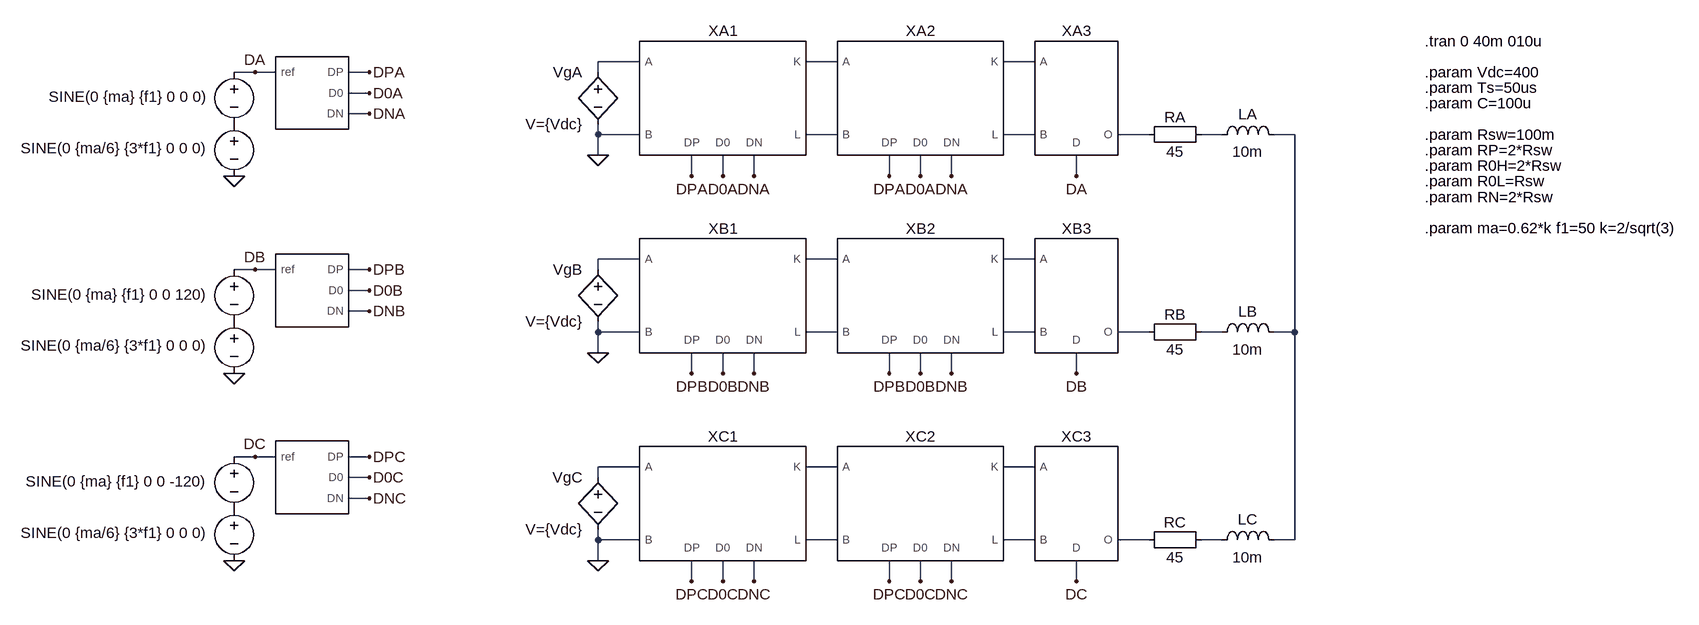
[diagram p0: schematic PN_3ph_6L_inverter.asc]
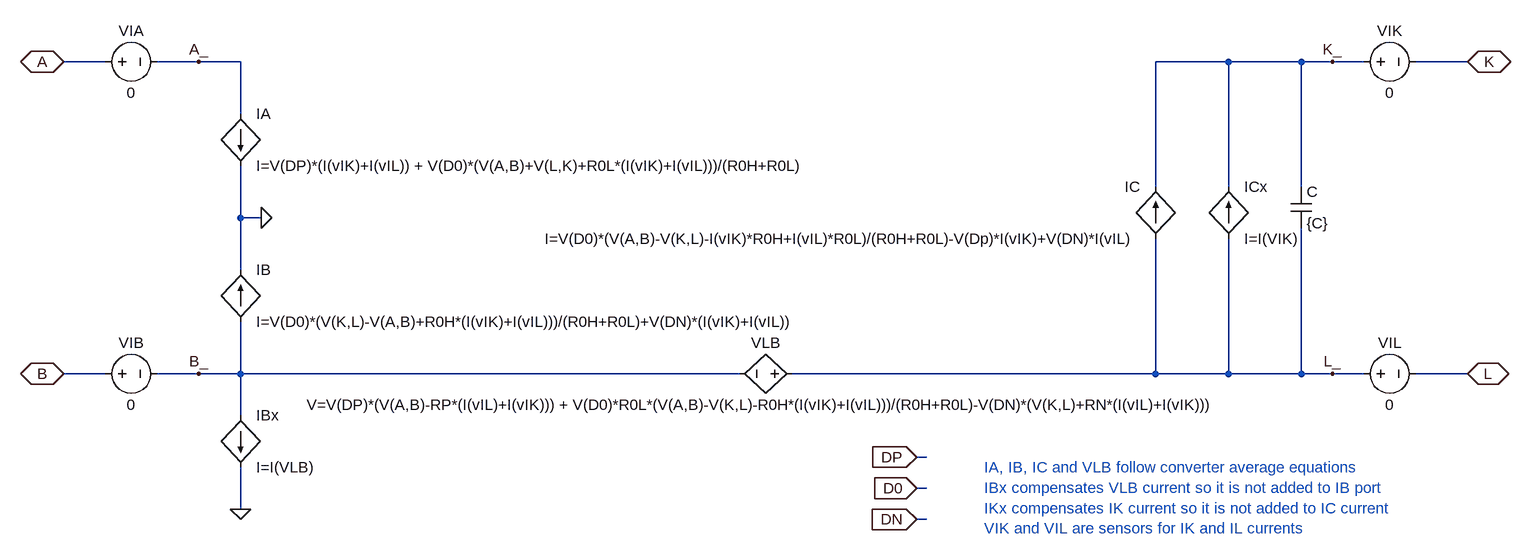
[diagram p1: sub-circuit pn_average_model.asc]
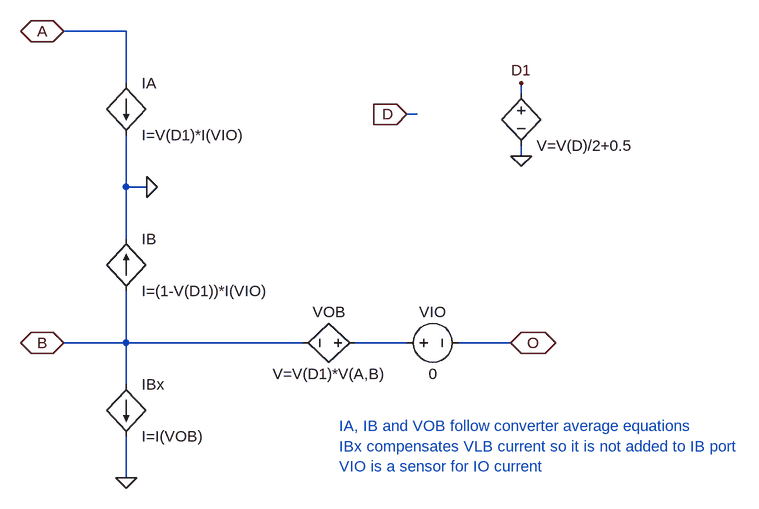
[diagram p2: sub-circuit 2l_average_model.asc]
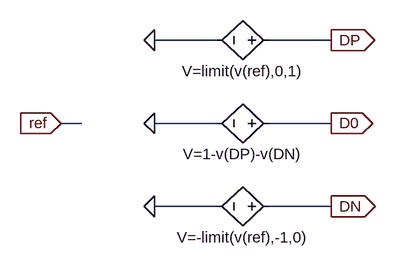
[diagram p3: sub-circuit pn_average_modulator.asc]
PN_3ph_6L_inverter.asc, the LTspice schematic file:
Version 4
SHEET 1 4356 1844
WIRE 1872 -1504 1808 -1504
WIRE 2176 -1504 2128 -1504
WIRE 2480 -1504 2432 -1504
WIRE 1280 -1488 1248 -1488
WIRE 1312 -1488 1280 -1488
WIRE 1456 -1488 1424 -1488
WIRE 1808 -1488 1808 -1504
WIRE 1456 -1456 1424 -1456
WIRE 1456 -1424 1424 -1424
WIRE 1808 -1392 1808 -1408
WIRE 1872 -1392 1808 -1392
WIRE 2176 -1392 2128 -1392
WIRE 2480 -1392 2432 -1392
WIRE 2656 -1392 2608 -1392
WIRE 2768 -1392 2736 -1392
WIRE 2880 -1392 2848 -1392
WIRE 1808 -1360 1808 -1392
WIRE 1952 -1328 1952 -1360
WIRE 2000 -1328 2000 -1360
WIRE 2048 -1328 2048 -1360
WIRE 2256 -1328 2256 -1360
WIRE 2304 -1328 2304 -1360
WIRE 2352 -1328 2352 -1360
WIRE 2544 -1328 2544 -1360
WIRE 1872 -1200 1808 -1200
WIRE 2176 -1200 2128 -1200
WIRE 2480 -1200 2432 -1200
WIRE 1280 -1184 1248 -1184
WIRE 1312 -1184 1280 -1184
WIRE 1456 -1184 1424 -1184
WIRE 1808 -1184 1808 -1200
WIRE 1456 -1152 1424 -1152
WIRE 1456 -1120 1424 -1120
WIRE 1808 -1088 1808 -1104
WIRE 1872 -1088 1808 -1088
WIRE 2176 -1088 2128 -1088
WIRE 2480 -1088 2432 -1088
WIRE 2656 -1088 2608 -1088
WIRE 2768 -1088 2736 -1088
WIRE 2880 -1088 2880 -1392
WIRE 2880 -1088 2848 -1088
WIRE 1808 -1056 1808 -1088
WIRE 1952 -1024 1952 -1056
WIRE 2000 -1024 2000 -1056
WIRE 2048 -1024 2048 -1056
WIRE 2256 -1024 2256 -1056
WIRE 2304 -1024 2304 -1056
WIRE 2352 -1024 2352 -1056
WIRE 2544 -1024 2544 -1056
WIRE 1280 -896 1248 -896
WIRE 1312 -896 1280 -896
WIRE 1456 -896 1424 -896
WIRE 1872 -880 1808 -880
WIRE 2176 -880 2128 -880
WIRE 2480 -880 2432 -880
WIRE 1456 -864 1424 -864
WIRE 1808 -864 1808 -880
WIRE 1456 -832 1424 -832
WIRE 1808 -768 1808 -784
WIRE 1872 -768 1808 -768
WIRE 2176 -768 2128 -768
WIRE 2480 -768 2432 -768
WIRE 2656 -768 2608 -768
WIRE 2768 -768 2736 -768
WIRE 2880 -768 2880 -1088
WIRE 2880 -768 2848 -768
WIRE 1808 -736 1808 -768
WIRE 1952 -704 1952 -736
WIRE 2000 -704 2000 -736
WIRE 2048 -704 2048 -736
WIRE 2256 -704 2256 -736
WIRE 2304 -704 2304 -736
WIRE 2352 -704 2352 -736
WIRE 2544 -704 2544 -736
FLAG 1456 -1488 DPA
FLAG 1456 -1456 D0A
FLAG 1456 -1424 DNA
FLAG 1952 -1328 DPA
FLAG 2000 -1328 D0A
FLAG 2048 -1328 DNA
FLAG 1808 -1360 0
FLAG 1952 -1024 DPB
FLAG 2000 -1024 D0B
FLAG 2048 -1024 DNB
FLAG 1808 -1056 0
FLAG 1952 -704 DPC
FLAG 2000 -704 D0C
FLAG 2048 -704 DNC
FLAG 1808 -736 0
FLAG 1248 -1328 0
FLAG 2256 -1328 DPA
FLAG 2304 -1328 D0A
FLAG 2352 -1328 DNA
FLAG 1456 -1184 DPB
FLAG 1456 -1152 D0B
FLAG 1456 -1120 DNB
FLAG 1248 -1024 0
FLAG 1456 -896 DPC
FLAG 1456 -864 D0C
FLAG 1456 -832 DNC
FLAG 1248 -736 0
FLAG 2256 -1024 DPB
FLAG 2304 -1024 D0B
FLAG 2352 -1024 DNB
FLAG 2256 -704 DPC
FLAG 2304 -704 D0C
FLAG 2352 -704 DNC
FLAG 1280 -896 DC
FLAG 1280 -1184 DB
FLAG 1280 -1488 DA
FLAG 2544 -1328 DA
FLAG 2544 -1024 DB
FLAG 2544 -704 DC
SYMBOL bv 1808 -1504 M0
SYMATTR InstName VgA
SYMATTR Value V={Vdc}
SYMBOL Misc/EuropeanResistor 2640 -1376 R270
WINDOW 0 27 56 VTop 2
WINDOW 3 5 56 VBottom 2
SYMATTR InstName RA
SYMATTR Value 45
SYMBOL ind 2752 -1376 R270
WINDOW 0 32 56 VTop 2
WINDOW 3 5 56 VBottom 2
SYMATTR InstName LA
SYMATTR Value 10m
SYMBOL PN_average_model 2000 -1456 R0
SYMATTR InstName XA1
SYMATTR SpiceLine C={C} RP={RP} R0H={R0H} R0L={R0L} RN={RN}
SYMBOL PN_average_model 2304 -1456 R0
SYMATTR InstName XA2
SYMATTR SpiceLine C={C} RP={RP} R0H={R0H} R0L={R0L} RN={RN}
SYMBOL bv 1808 -1200 M0
SYMATTR InstName VgB
SYMATTR Value V={Vdc}
SYMBOL Misc/EuropeanResistor 2640 -1072 R270
WINDOW 0 27 56 VTop 2
WINDOW 3 5 56 VBottom 2
SYMATTR InstName RB
SYMATTR Value 45
SYMBOL ind 2752 -1072 R270
WINDOW 0 32 56 VTop 2
WINDOW 3 5 56 VBottom 2
SYMATTR InstName LB
SYMATTR Value 10m
SYMBOL PN_average_model 2000 -1152 R0
SYMATTR InstName XB1
SYMATTR SpiceLine C={C} RP={RP} R0H={R0H} R0L={R0L} RN={RN}
SYMBOL PN_average_model 2304 -1152 R0
SYMATTR InstName XB2
SYMATTR SpiceLine C={C} RP={RP} R0H={R0H} R0L={R0L} RN={RN}
SYMBOL bv 1808 -880 M0
SYMATTR InstName VgC
SYMATTR Value V={Vdc}
SYMBOL Misc/EuropeanResistor 2640 -752 R270
WINDOW 0 27 56 VTop 2
WINDOW 3 5 56 VBottom 2
SYMATTR InstName RC
SYMATTR Value 45
SYMBOL ind 2752 -752 R270
WINDOW 0 32 56 VTop 2
WINDOW 3 5 56 VBottom 2
SYMATTR InstName LC
SYMATTR Value 10m
SYMBOL PN_average_model 2000 -832 R0
SYMATTR InstName XC1
SYMATTR SpiceLine C={C} RP={RP} R0H={R0H} R0L={R0L} RN={RN}
SYMBOL PN_average_model 2304 -832 R0
SYMATTR InstName XC2
SYMATTR SpiceLine C={C} RP={RP} R0H={R0H} R0L={R0L} RN={RN}
SYMBOL voltage 1248 -1504 M0
WINDOW 0 24 16 Invisible 2
WINDOW 3 39 54 Left 2
SYMATTR InstName V1
SYMATTR Value SINE(0 {ma} {f1} 0 0 0)
SYMBOL voltage 1248 -1424 M0
WINDOW 0 24 16 Invisible 2
WINDOW 3 39 53 Left 2
SYMATTR InstName V2
SYMATTR Value SINE(0 {ma/6} {3*f1} 0 0 0)
SYMBOL voltage 1248 -1200 M0
WINDOW 0 24 16 Invisible 2
WINDOW 3 39 54 Left 2
SYMATTR InstName V3
SYMATTR Value SINE(0 {ma} {f1} 0 0 120)
SYMBOL voltage 1248 -1120 M0
WINDOW 0 24 16 Invisible 2
WINDOW 3 39 53 Left 2
SYMATTR InstName V4
SYMATTR Value SINE(0 {ma/6} {3*f1} 0 0 0)
SYMBOL voltage 1248 -912 M0
WINDOW 0 24 16 Invisible 2
WINDOW 3 39 54 Left 2
SYMATTR InstName V5
SYMATTR Value SINE(0 {ma} {f1} 0 0 -120)
SYMBOL voltage 1248 -832 M0
WINDOW 0 24 16 Invisible 2
WINDOW 3 39 53 Left 2
SYMATTR InstName V6
SYMATTR Value SINE(0 {ma/6} {3*f1} 0 0 0)
SYMBOL 2L_average_model 2544 -1472 R0
SYMATTR InstName XA3
SYMBOL 2L_average_model 2544 -1168 R0
SYMATTR InstName XB3
SYMBOL 2L_average_model 2544 -848 R0
SYMATTR InstName XC3
SYMBOL PN_average_modulator 1360 -1456 R0
WINDOW 0 8 -56 Invisible 2
SYMATTR InstName X1
SYMBOL PN_average_modulator 1360 -1152 R0
WINDOW 0 8 -56 Invisible 2
SYMATTR InstName X2
SYMBOL PN_average_modulator 1360 -864 R0
WINDOW 0 8 -56 Invisible 2
SYMATTR InstName X3
TEXT 3080 -1464 Left 2 !.param Ts=50us
TEXT 3080 -1536 Left 2 !.tran 0 40m 010u
TEXT 3080 -1488 Left 2 !.param Vdc=400
TEXT 3080 -1248 Left 2 !.param ma=0.62*k f1=50 k=2/sqrt(3)
TEXT 3080 -1392 Left 2 !.param Rsw=100m
TEXT 3080 -1368 Left 2 !.param RP=2*Rsw
TEXT 3080 -1296 Left 2 !.param RN=2*Rsw
TEXT 3080 -1344 Left 2 !.param R0H=2*Rsw
TEXT 3080 -1320 Left 2 !.param R0L=Rsw
TEXT 3080 -1440 Left 2 !.param C=100u

pn_average_model.asc, the sub-circuit schematic file:
Version 4
SHEET 1 2060 780
WIRE -720 16 -784 16
WIRE -576 16 -640 16
WIRE -512 16 -576 16
WIRE 1008 16 896 16
WIRE 1120 16 1008 16
WIRE 1168 16 1120 16
WIRE 1216 16 1168 16
WIRE 1376 16 1296 16
WIRE -512 96 -512 16
WIRE 896 208 896 16
WIRE 1008 208 1008 16
WIRE 1120 208 1120 16
WIRE -512 256 -512 176
WIRE -480 256 -512 256
WIRE -512 336 -512 256
WIRE -720 496 -784 496
WIRE -576 496 -640 496
WIRE -512 496 -512 416
WIRE -512 496 -576 496
WIRE 256 496 -512 496
WIRE 896 496 896 288
WIRE 896 496 336 496
WIRE 1008 496 1008 288
WIRE 1008 496 896 496
WIRE 1120 496 1120 272
WIRE 1120 496 1008 496
WIRE 1168 496 1120 496
WIRE 1216 496 1168 496
WIRE 1376 496 1296 496
WIRE -512 560 -512 496
WIRE 544 624 528 624
WIRE 544 672 528 672
WIRE -512 704 -512 640
WIRE 544 720 528 720
FLAG 1376 16 K
IOPIN 1376 16 BiDir
FLAG 1376 496 L
IOPIN 1376 496 BiDir
FLAG -784 16 A
IOPIN -784 16 BiDir
FLAG -784 496 B
IOPIN -784 496 BiDir
FLAG 528 624 DP
IOPIN 528 624 In
FLAG 528 672 D0
IOPIN 528 672 In
FLAG 528 720 DN
IOPIN 528 720 In
FLAG -480 256 0
FLAG -512 704 0
FLAG -576 16 A_
FLAG -576 496 B_
FLAG 1168 16 K_
FLAG 1168 496 L_
SYMBOL bv 352 496 R90
WINDOW 0 -32 56 VBottom 2
WINDOW 3 32 56 VTop 2
SYMATTR InstName VLB
SYMATTR Value V=V(DP)*(V(A,B)-RP*(I(vIL)+I(vIK))) + V(D0)*R0L*(V(A,B)-V(K,L)-R0H*(I(vIK)+I(vIL)))/(R0H+R0L)-V(DN)*(V(K,L)+RN*(I(vIL)+I(vIK)))
SYMBOL bi -512 96 R0
SYMATTR InstName IA
SYMATTR Value I=V(DP)*(I(vIK)+I(vIL)) + V(D0)*(V(A,B)+V(L,K)+R0L*(I(vIK)+I(vIL)))/(R0H+R0L)
SYMBOL cap 1104 208 R0
SYMATTR InstName C
SYMATTR Value {C}
SYMBOL bi 896 288 R180
WINDOW 0 24 80 Left 2
WINDOW 3 24 0 Left 2
SYMATTR InstName IC
SYMATTR Value I=V(D0)*(V(A,B)-V(K,L)-I(vIK)*R0H+I(vIL)*R0L)/(R0H+R0L)-V(Dp)*I(vIK)+V(DN)*I(vIL)
SYMBOL bi -512 416 M180
WINDOW 0 24 80 Left 2
WINDOW 3 24 0 Left 2
SYMATTR InstName IB
SYMATTR Value I=V(D0)*(V(K,L)-V(A,B)+R0H*(I(vIK)+I(vIL)))/(R0H+R0L)+V(DN)*(I(vIK)+I(vIL))
SYMBOL voltage 1200 496 R270
WINDOW 0 32 56 VTop 2
WINDOW 3 -32 56 VBottom 2
SYMATTR InstName VIL
SYMATTR Value 0
SYMBOL voltage 1200 16 R270
WINDOW 0 32 56 VTop 2
WINDOW 3 -32 56 VBottom 2
SYMATTR InstName VIK
SYMATTR Value 0
SYMBOL bi -512 560 R0
SYMATTR InstName IBx
SYMATTR Value I=I(VLB)
SYMBOL bi 1008 288 M180
WINDOW 0 24 80 Left 2
WINDOW 3 24 0 Left 2
SYMATTR InstName ICx
SYMATTR Value I=I(VIK)
SYMBOL voltage -736 496 R270
WINDOW 0 32 56 VTop 2
WINDOW 3 -32 56 VBottom 2
SYMATTR InstName VIB
SYMATTR Value 0
SYMBOL voltage -736 16 R270
WINDOW 0 32 56 VTop 2
WINDOW 3 -32 56 VBottom 2
SYMATTR InstName VIA
SYMATTR Value 0
TEXT 632 640 Left 2 ;IA, IB, IC and VLB follow converter average equations\nIBx compensates VLB current so it is not added to IB port\nIKx compensates IK current so it is not added to IC current\nVIK and VIL are sensors for IK and IL currents

2l_average_model.asc, the sub-circuit schematic file:
Version 4
SHEET 1 2060 780
WIRE -512 16 -608 16
WIRE -512 96 -512 16
WIRE 96 112 96 96
WIRE -64 144 -80 144
WIRE 96 208 96 192
WIRE -512 256 -512 176
WIRE -480 256 -512 256
WIRE -512 336 -512 256
WIRE -512 496 -512 416
WIRE -512 496 -608 496
WIRE -240 496 -512 496
WIRE -80 496 -160 496
WIRE 80 496 0 496
WIRE -512 560 -512 496
WIRE -512 704 -512 640
FLAG 80 496 O
IOPIN 80 496 BiDir
FLAG -608 16 A
IOPIN -608 16 BiDir
FLAG -608 496 B
IOPIN -608 496 BiDir
FLAG -80 144 D
IOPIN -80 144 In
FLAG -480 256 0
FLAG -512 704 0
FLAG 96 208 0
FLAG 96 96 D1
SYMBOL bv -144 496 R90
WINDOW 0 -32 56 VBottom 2
WINDOW 3 32 56 VTop 2
SYMATTR InstName VOB
SYMATTR Value V=V(D1)*V(A,B)
SYMBOL bi -512 96 R0
SYMATTR InstName IA
SYMATTR Value I=V(D1)*I(VIO)
SYMBOL bi -512 416 M180
WINDOW 0 24 80 Left 2
WINDOW 3 24 0 Left 2
SYMATTR InstName IB
SYMATTR Value I=(1-V(D1))*I(VIO)
SYMBOL voltage -96 496 R270
WINDOW 0 32 56 VTop 2
WINDOW 3 -32 56 VBottom 2
SYMATTR InstName VIO
SYMATTR Value 0
SYMBOL bi -512 560 R0
SYMATTR InstName IBx
SYMATTR Value I=I(VOB)
SYMBOL bv 96 96 R0
WINDOW 0 24 16 Invisible 2
SYMATTR InstName VD
SYMATTR Value V=V(D)/2+0.5
TEXT -184 624 Left 2 ;IA, IB and VOB follow converter average equations\nIBx compensates VLB current so it is not added to IB port\nVIO is a sensor for IO current

pn_average_modulator.asc, the sub-circuit schematic file:
Version 4
SHEET 1 880 680
WIRE 304 160 208 160
WIRE 480 160 384 160
WIRE 96 288 64 288
WIRE 304 288 208 288
WIRE 480 288 384 288
WIRE 304 416 208 416
WIRE 480 416 384 416
FLAG 208 160 0
FLAG 208 288 0
FLAG 208 416 0
FLAG 480 160 DP
IOPIN 480 160 Out
FLAG 480 288 D0
IOPIN 480 288 Out
FLAG 480 416 DN
IOPIN 480 416 Out
FLAG 64 288 ref
IOPIN 64 288 In
SYMBOL bv 400 160 R90
WINDOW 0 -32 56 Invisible 2
WINDOW 3 32 56 VTop 2
SYMATTR InstName Bpos1
SYMATTR Value V=limit(v(ref),0,1)
SYMBOL bv 400 288 R90
WINDOW 0 -32 56 Invisible 2
WINDOW 3 32 56 VTop 2
SYMATTR InstName Bzero1
SYMATTR Value V=1-v(DP)-v(DN)
SYMBOL bv 400 416 R90
WINDOW 0 -32 56 Invisible 2
WINDOW 3 32 56 VTop 2
SYMATTR InstName Bneg1
SYMATTR Value V=-limit(v(ref),-1,0)

The netlist it stands for:
* PN_3ph_6L_inverter.asc
B§VgA N001 0 V={Vdc}
RA N006 N007 45
LA N007 N008 10m
XXA1 D0A DNA DPA N001 0 N002 N004 pn_average_model params: C={C} RP={RP} R0H={R0H} R0L={R0L} RN={RN}
XXA2 D0A DNA DPA N002 N004 N003 N005 pn_average_model params: C={C} RP={RP} R0H={R0H} R0L={R0L} RN={RN}
B§VgB N009 0 V={Vdc}
RB N014 N015 45
LB N015 N008 10m
XXB1 D0B DNB DPB N009 0 N010 N012 pn_average_model params: C={C} RP={RP} R0H={R0H} R0L={R0L} RN={RN}
XXB2 D0B DNB DPB N010 N012 N011 N013 pn_average_model params: C={C} RP={RP} R0H={R0H} R0L={R0L} RN={RN}
B§VgC N016 0 V={Vdc}
RC N021 N022 45
LC N022 N008 10m
XXC1 D0C DNC DPC N016 0 N017 N019 pn_average_model params: C={C} RP={RP} R0H={R0H} R0L={R0L} RN={RN}
XXC2 D0C DNC DPC N017 N019 N018 N020 pn_average_model params: C={C} RP={RP} R0H={R0H} R0L={R0L} RN={RN}
V1 DA P001 SINE(0 {ma} {f1} 0 0 0)
V2 P001 0 SINE(0 {ma/6} {3*f1} 0 0 0)
V3 DB P002 SINE(0 {ma} {f1} 0 0 120)
V4 P002 0 SINE(0 {ma/6} {3*f1} 0 0 0)
V5 DC P003 SINE(0 {ma} {f1} 0 0 -120)
V6 P003 0 SINE(0 {ma/6} {3*f1} 0 0 0)
XXA3 DA N003 N005 N006 2l_average_model
XXB3 DB N011 N013 N014 2l_average_model
XXC3 DC N018 N020 N021 2l_average_model
XX1 DA D0A DNA DPA pn_average_modulator
XX2 DB D0B DNB DPB pn_average_modulator
XX3 DC D0C DNC DPC pn_average_modulator

* block symbol definitions
.subckt pn_average_model D0 DN DP A B K L
B§VLB L_ B_ V=V(DP)*(V(A,B)-RP*(I(vIL)+I(vIK))) + V(D0)*R0L*(V(A,B)-V(K,L)-R0H*(I(vIK)+I(vIL)))/(R0H+R0L)-V(DN)*(V(K,L)+RN*(I(vIL)+I(vIK)))
B§IA A_ 0 I=V(DP)*(I(vIK)+I(vIL)) + V(D0)*(V(A,B)+V(L,K)+R0L*(I(vIK)+I(vIL)))/(R0H+R0L)
C K_ L_ {C}
B§IC L_ K_ I=V(D0)*(V(A,B)-V(K,L)-I(vIK)*R0H+I(vIL)*R0L)/(R0H+R0L)-V(Dp)*I(vIK)+V(DN)*I(vIL)
B§IB B_ 0 I=V(D0)*(V(K,L)-V(A,B)+R0H*(I(vIK)+I(vIL)))/(R0H+R0L)+V(DN)*(I(vIK)+I(vIL))
VIL L_ L 0
VIK K_ K 0
B§IBx B_ 0 I=I(VLB)
B§ICx L_ K_ I=I(VIK)
VIB B B_ 0
VIA A A_ 0
* IA, IB, IC and VLB follow converter average equations
* IBx compensates VLB current so it is not added to IB port
* IKx compensates IK current so it is not added to IC current
* VIK and VIL are sensors for IK and IL currents
.ends pn_average_model

.subckt 2l_average_model D A B O
B§VOB N001 B V=V(D1)*V(A,B)
B§IA A 0 I=V(D1)*I(VIO)
B§IB B 0 I=(1-V(D1))*I(VIO)
VIO N001 O 0
B§IBx B 0 I=I(VOB)
B§VD D1 0 V=V(D)/2+0.5
* IA, IB and VOB follow converter average equations
* IBx compensates VLB current so it is not added to IB port
* VIO is a sensor for IO current
.ends 2l_average_model

.subckt pn_average_modulator ref D0 DN DP
Bpos1 DP 0 V=limit(v(ref),0,1)
Bzero1 D0 0 V=1-v(DP)-v(DN)
Bneg1 DN 0 V=-limit(v(ref),-1,0)
.ends pn_average_modulator

.param Ts=50us
.tran 0 40m 010u
.param Vdc=400
.param ma=0.62*k f1=50 k=2/sqrt(3)
.param Rsw=100m
.param RP=2*Rsw
.param RN=2*Rsw
.param R0H=2*Rsw
.param R0L=Rsw
.param C=100u
.backanno
.end